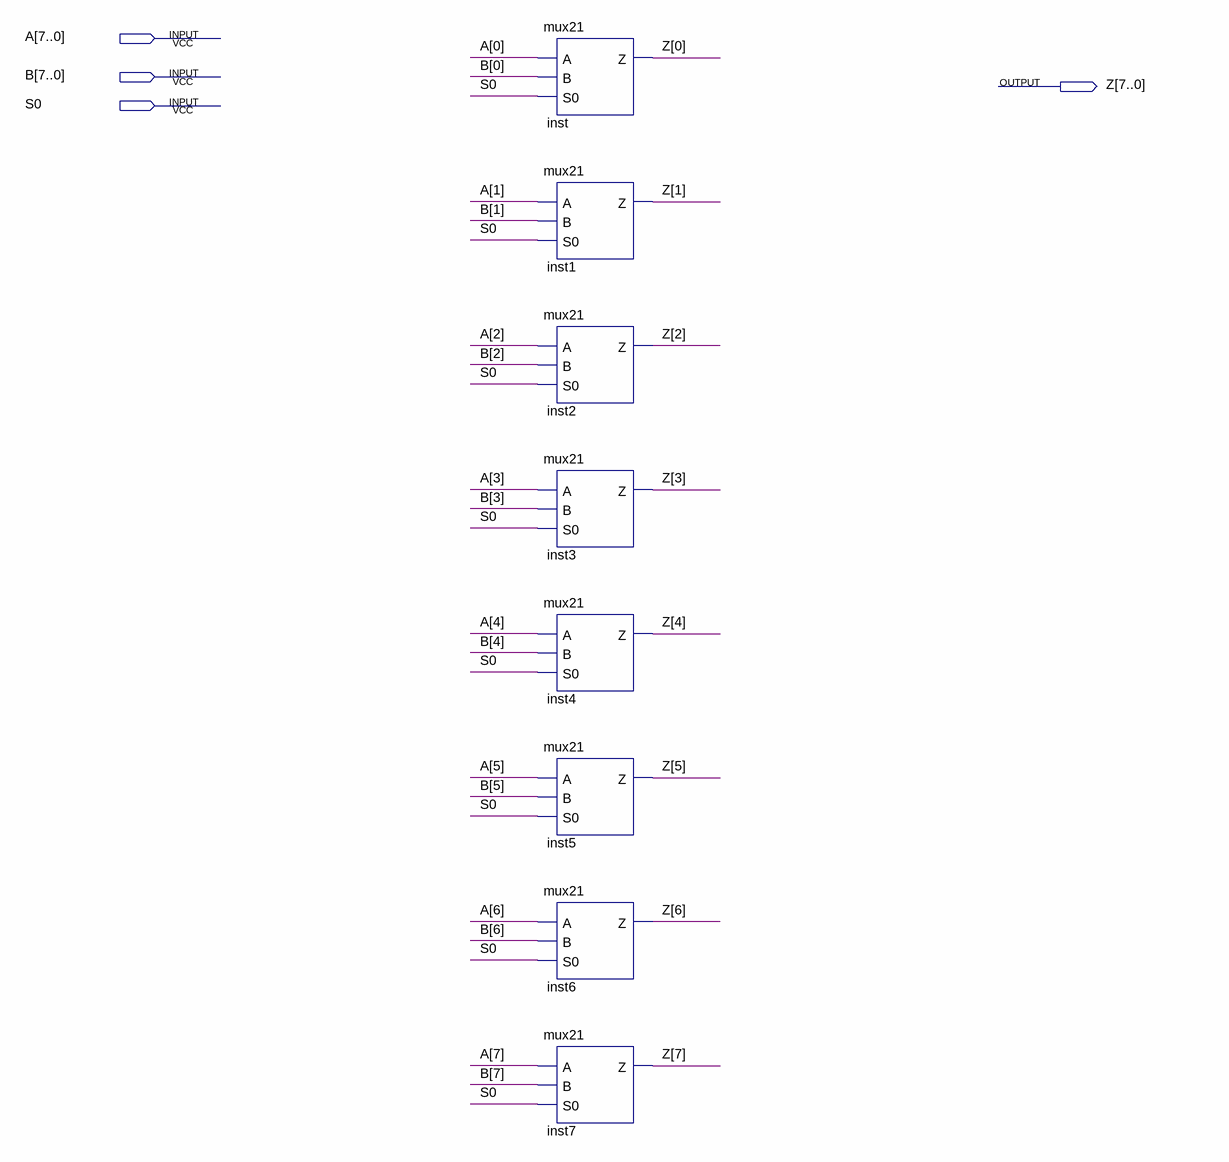
[diagram p0: schematic sheet]
// Quartus schematic Mux8bits21.bdf as structural Verilog: 8 symbols, 4 pins
module Mux8bits21 (
  input  [7:0] A,
  input  [7:0] B,
  input  S0,
  output [7:0] Z
);

  mux21 inst (.A(A[0]), .B(B[0]), .S0(S0), .Z(Z[0]));
  mux21 inst1 (.A(A[1]), .B(B[1]), .S0(S0), .Z(Z[1]));
  mux21 inst2 (.A(A[2]), .B(B[2]), .S0(S0), .Z(Z[2]));
  mux21 inst3 (.A(A[3]), .B(B[3]), .S0(S0), .Z(Z[3]));
  mux21 inst4 (.A(A[4]), .B(B[4]), .S0(S0), .Z(Z[4]));
  mux21 inst5 (.A(A[5]), .B(B[5]), .S0(S0), .Z(Z[5]));
  mux21 inst6 (.A(A[6]), .B(B[6]), .S0(S0), .Z(Z[6]));
  mux21 inst7 (.A(A[7]), .B(B[7]), .S0(S0), .Z(Z[7]));
endmodule
